# Altium schematic sheet SwitchDecoder.SchDoc
size A3
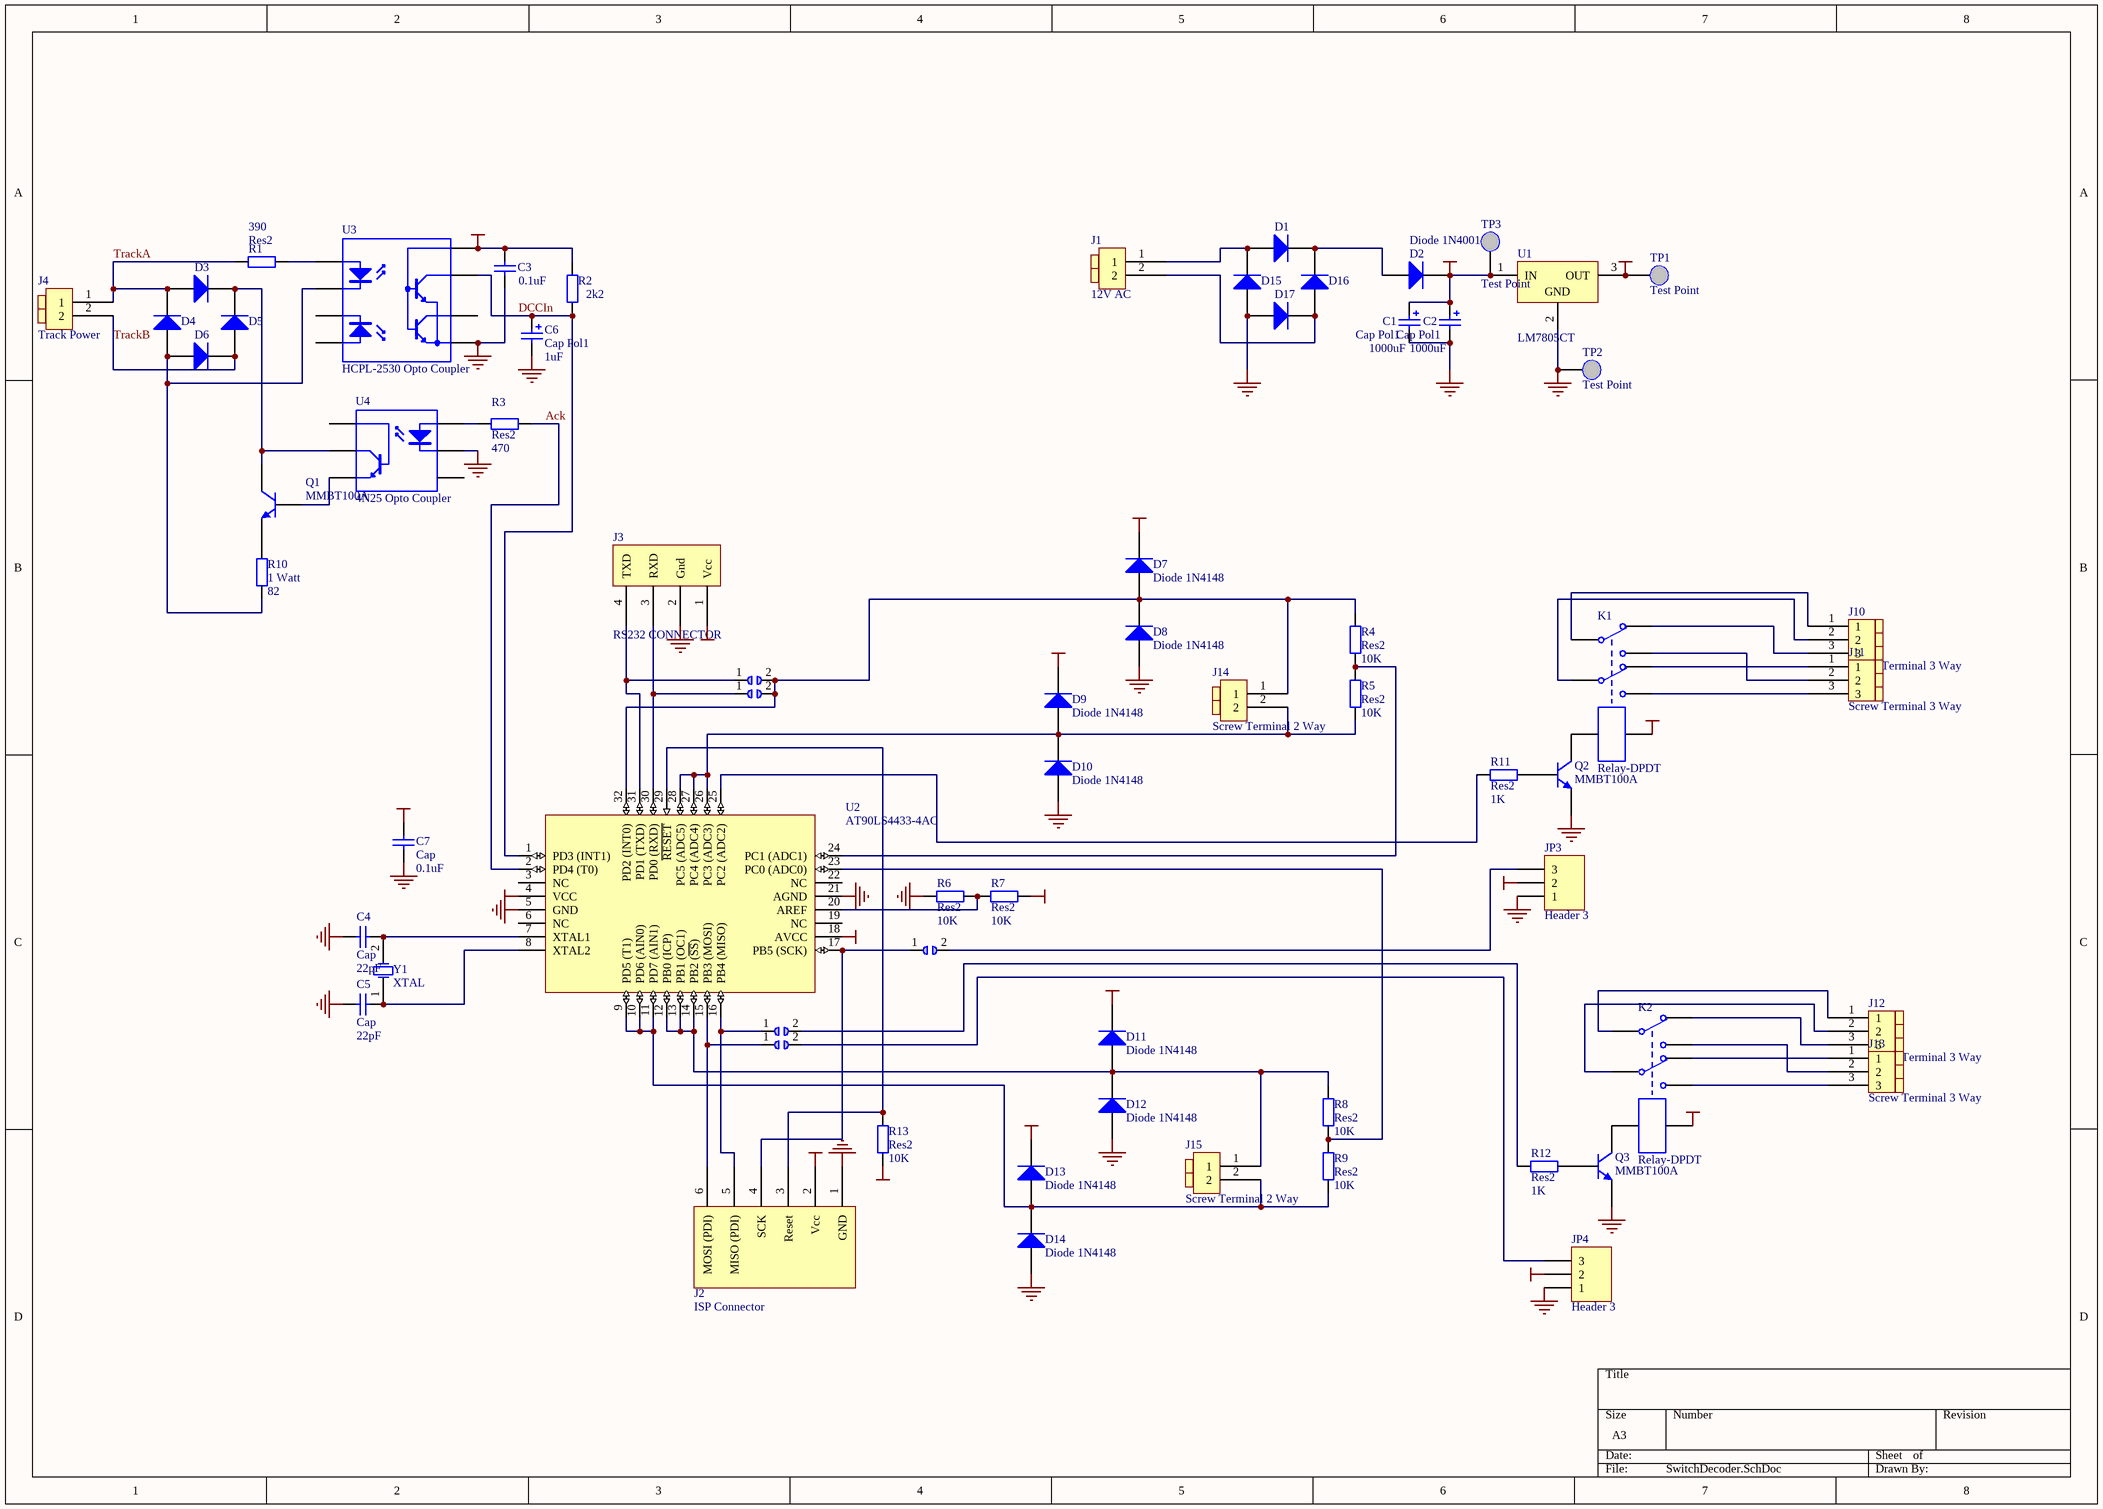
[diagram p0: SwitchDecoder.SchDoc]

## Parts
C1  Cap Pol1  value 1000uF  [CAPPR5-10X10.5]
C2  Cap Pol1  value 1000uF  [CAPPR5-10X10.5]
C3  value 0.1uF  [CC2012-0805]  (hidden comment: Cap)
C4  Cap  value 22pF  [CC2012-0805]
C5  Cap  value 22pF  [CC2012-0805]
C6  Cap Pol1  value 1uF  [CC3216-1206]
C7  Cap  value 0.1uF  [CC2012-0805]
D1  Diode 1N4004  [DIO10.46-5.3x2.8]  (value not drawn)
D2  Diode 1N4001  [DIO10.46-5.3x2.8]
D3  Diode 1N4148  [DIO7.1-3.9x1.9]  (value not drawn)
D4  Diode 1N4148  [DIO7.1-3.9x1.9]  (value not drawn)
D5  Diode 1N4148  [DIO7.1-3.9x1.9]  (value not drawn)
D6  Diode 1N4148  [DIO7.1-3.9x1.9]  (value not drawn)
D7  Diode 1N4148  [DIO7.1-3.9x1.9]
D8  Diode 1N4148  [DIO7.1-3.9x1.9]
D9  Diode 1N4148  [DIO7.1-3.9x1.9]
D10  Diode 1N4148  [DIO7.1-3.9x1.9]
D11  Diode 1N4148  [DIO7.1-3.9x1.9]
D12  Diode 1N4148  [DIO7.1-3.9x1.9]
D13  Diode 1N4148  [DIO7.1-3.9x1.9]
D14  Diode 1N4148  [DIO7.1-3.9x1.9]
D15  Diode 1N4004  [DIO10.46-5.3x2.8]  (value not drawn)
D16  Diode 1N4004  [DIO10.46-5.3x2.8]  (value not drawn)
D17  Diode 1N4004  [DIO10.46-5.3x2.8]  (value not drawn)
J1  12V AC  [Screw Terminal 2 way 0.2]
J2  ISP Connector  [0.1 SIP 6 PIN]
J3  RS232 CONNECTOR  [0.1 SIP 4 PIN]
J4  Track Power  [Screw Terminal 2 way 0.2]
J5  Jumper  [Jumper]  (value not drawn)
J6  Jumper  [Jumper]  (value not drawn)
J7  Jumper  [Jumper]  (value not drawn)
J8  Jumper  [Jumper]  (value not drawn)
J9  Jumper  [Jumper]  (value not drawn)
J10  Screw Terminal 3 Way  [Screw Terminal 3 way 0.2]
J11  Screw Terminal 3 Way  [Screw Terminal 3 way 0.2]
J12  Screw Terminal 3 Way  [Screw Terminal 3 way 0.2]
J13  Screw Terminal 3 Way  [Screw Terminal 3 way 0.2]
J14  Screw Terminal 2 Way  [Screw Terminal 2 way 0.2]
J15  Screw Terminal 2 Way  [Screw Terminal 2 way 0.2]
JP3  Header 3  [HDR1X3]
JP4  Header 3  [HDR1X3]
K1  Relay-DPDT  [RelayDPDT]
K2  Relay-DPDT  [RelayDPDT]
Q1  MMBT100A  [SO-G3]
Q2  MMBT100A  [SO-G3]
Q3  MMBT100A  [SO-G3]
R1  Res2  value 390  [CR2012-0805]
R2  value 2k2  [CR2012-0805]  (hidden comment: Res2)
R3  Res2  value 470  [CR2012-0805]
R4  Res2  value 10K  [CR2012-0805]
R5  Res2  value 10K  [CR2012-0805]
R6  Res2  value 10K  [CR2012-0805]
R7  Res2  value 10K  [CR2012-0805]
R8  Res2  value 10K  [CR2012-0805]
R9  Res2  value 10K  [CR2012-0805]
R10  1 Watt  value 82  [AXIAL-0.6]
R11  Res2  value 1K  [CR2012-0805]
R12  Res2  value 1K  [CR2012-0805]
R13  Res2  value 10K  [CR2012-0805]
TP1  Test Point  [TestPoint]
TP2  Test Point  [TestPoint]
TP3  Test Point  [TestPoint]
U1  LM7805CT  [TO-3 with HS Clip]
U2  AT90LS4433-4AC  [32A]
U3  HCPL-2530 Opto Coupler  [8P3]
U4  4N25 Opto Coupler  [DIP6]
Y1  XTAL  [RAD-0.2]

## Nets
GND: C1.2 C2.2 C3.1 C4.1 C5.1 C6.2 C7.1 D8.1(A) D10.1(A) D12.1(A) D14.1(A) D15.1(A) D17.1(A) J2.1(GND) J3.2(Gnd) JP3.1 JP4.1 Q2.2(E) Q3.2(E) R6.1 TP2.1 U1.2(GND) U2.5(GND) U2.21(AGND) U3.5(E) U4.2(K)
VCC: C3.2 C7.2 D7.2(K) D9.2(K) D11.2(K) D13.2(K) J2.2(Vcc) J3.1(Vcc) JP3.2 JP4.2 R2.2 R7.2 R13.1 TP1.1 U1.3(OUT) U2.4(VCC) U2.18(AVCC) U3.8(E)
Vdd: C1.1 C2.1 D2.2(K) K1.8 K2.8 TP3.1 U1.1(IN)
Ack: R3.2 U2.2(PD4_(T0))
DCCIn: C6.1 R2.1 U2.1(PD3_(INT1)) U3.7(C)
TrackA: D3.1(A) D4.2(K) J4.1 R1.2
TrackB: D5.1(A) D6.2(K) J4.2
NetC4_2: C4.2 U2.7(XTAL1) Y1.2(OSC2)
NetC5_2: C5.2 U2.8(XTAL2) Y1.1(OSC1)
NetD1_1: D1.1(A) D15.2(K) J1.1
NetD1_2: D1.2(K) D2.1(A) D16.2(K)
NetD3_2: D3.2(K) D5.2(K) Q1.3(C) U4.5(C)
NetD4_1: D4.1(A) D6.1(A) R10.2 U3.2(K)
NetD7_1: D7.1(A) D8.2(K) J5.2 J6.2 J14.1 R4.2 U2.32(PD2_(INT0))
NetD9_1: D9.1(A) D10.2(K) J14.2 R5.1 U2.26(PC3_(ADC3)) U2.27(PC4_(ADC4)) U2.28(PC5_(ADC5))
NetD11_1: D11.1(A) D12.2(K) J15.1 R8.2 U2.12(PB0_(ICP)) U2.13(PB1_(OC1)) U2.14(PB2_(~{SS}))
NetD13_1: D13.1(A) D14.2(K) J15.2 R9.1 U2.9(PD5_(T1)) U2.10(PD6_(AIN0)) U2.11(PD7_(AIN1))
NetD16_1: D16.1(A) D17.2(K) J1.2
NetJ2_3: J2.3(Reset) R13.2 U2.29(~{RESET})
NetJ2_4: J2.4(SCK) J7.1 U2.17(PB5_(SCK))
NetJ2_5: J2.5(MISO_(PDI)) J8.1 U2.16(PB4_(MISO))
NetJ2_6: J2.6(MOSI_(PDI)) J9.1 U2.15(PB3_(MOSI))
NetJ3_3: J3.3(RXD) J6.1 U2.30(PD0_(RXD))
NetJ3_4: J3.4(TXD) J5.1 U2.31(PD1_(TXD))
NetJ7_2: J7.2 JP3.3
NetJ8_2: J8.2 R12.1
NetJ9_2: J9.2 JP4.3
NetJ10_1: J10.1 K1.1
NetJ10_2: J10.2 K1.4
NetJ10_3: J10.3 K1.2
NetJ11_1: J11.1 K1.5
NetJ11_2: J11.2 K1.3
NetJ11_3: J11.3 K1.6
NetJ12_1: J12.1 K2.1
NetJ12_2: J12.2 K2.4
NetJ12_3: J12.3 K2.2
NetJ13_1: J13.1 K2.5
NetJ13_2: J13.2 K2.3
NetJ13_3: J13.3 K2.6
NetK1_7: K1.7 Q2.3(C)
NetK2_7: K2.7 Q3.3(C)
NetQ1_1: Q1.1(B) U4.4(E)
NetQ1_2: Q1.2(E) R10.1
NetQ2_1: Q2.1(B) R11.2
NetQ3_1: Q3.1(B) R12.2
NetR1_1: R1.1 U3.1(A)
NetR3_1: R3.1 U4.1(K)
NetR4_1: R4.1 R5.2 U2.24(PC1_(ADC1))
NetR6_2: R6.2 R7.1 U2.20(AREF)
NetR8_1: R8.1 R9.2 U2.23(PC0_(ADC0))
NetR11_1: R11.1 U2.25(PC2_(ADC2))

Not connected (* = marked no-connect by the designer): U2 3(NC) 6(NC) 19(NC) 22(NC); U3 3(K) 4(A) 6(C); U4 3(N/C) 6(B)

## Library data of the parts
C1 C2 C6 = Cap Pol1: Polarized Capacitor (Radial); Published: 8-Jun-2000; Revision: July-2002: Re-released for DXP Platform.; Publisher: Altium Limited
C3-C5 C7 = Cap: Capacitor; Published: 8-Jun-2000; Revision: July-2002: Re-released for DXP Platform.; Publisher: Altium Limited
D1 D15-D17 = Diode 1N4004: 1 Amp General Purpose Rectifier; Revision 1: 11-Jul-2000: SIM Model Added.; Revision 2: 17-Jul-2002: Re-released for DXP Platform.; Package Information: Latest Revision: Aug-1999; Code - JEDEC: DO-204-AL; Published: 8-Jun-2000; Datasheet: Latest Revision: 1998; Package Reference: DO-41; Publisher: Altium Limited
D2 = Diode 1N4001: 1 Amp General Purpose Rectifier; Revision 1: 11-Jul-2000: SIM Model Added.; Revision 2: 17-Jul-2002: Re-released for DXP Platform.; Package Information: Latest Revision: Aug-1999; Code - JEDEC: DO-204-AL; Published: 8-Jun-2000; Datasheet: Latest Revision: 1998; Package Reference: DO-41; Publisher: Altium Limited
D3-D6 = Diode 1N4148: High Conductance Fast Diode; Revision 1: 11-Jul-2000: SIM Model Added.; Revision 2: 17-Jul-2002: Re-released for DXP Platform.; Code - JEDEC: DO-204-AH; Published: 8-Jun-2000; Datasheet: Latest Revision: 1997; Package Reference: DO-35; Publisher: Altium Limited
D7-D14 = Diode 1N4148: High Conductance Fast Diode; Code - JEDEC: DO-204-AH; Revision 1: 11-Jul-2000: SIM Model Added.; Revision 2: 17-Jul-2002: Re-released for DXP Platform.; Published: 8-Jun-2000; Publisher: Altium Limited; Datasheet: Latest Revision: 1997; Package Reference: DO-35
J1 J4 = Screw Terminal 2 Way
JP3 JP4 = Header 3: Header, 3-Pin; Revision: 17-Jul-2002: Re-released for DXP Platform.; Publisher: Altium Limited
K1 K2 = Relay-DPDT: Dual-Pole Dual-Throw Relay; Published: 24-Mar-1999; Revision: July-2002: Re-released for DXP Platform.; Publisher: Altium Limited
Q1-Q3 = MMBT100A: General Purpose Amplifier NPN Silicon; Package Information: Latest Revision: 1997; Published: 29-Sep-2000; Revision: 17-Jul-2002: Re-released for DXP Platform.; Datasheet: Latest Revision: 1996; Package Reference: 318-08; Publisher: Altium Limited
R1-R13 = Res2: Resistor; Published: 8-Jun-2000; Revision: July-2002: Re-released for DXP Platform.; Publisher: Altium Limited
TP1-TP3 = TestPoint
U1 = LM7805CT: Series 3-Terminal Positive Regulator; Package Information: Latest Revision: 1995; Note: Tab is connected to GND; Published: 15-Apr-2002; Datasheet: Latest Revision: May-1999; Package Reference: T03B; Publisher: Altium Limited
U2 = AT90LS4433-4AC: 8-Bit AVR Microcontroller with 4K Bytes of In-System Programmable Flash Memory; Package Information: Latest Revision: revB, Oct-2001; Code - JEDEC: MS-026-ABA; Published: 17-Sep-2003; Datasheet: Latest Revision: 1042G-AVR-09/02; Package Reference: 32A; Publisher: Altium Limited
U3 = HCPL-2530
U4 = 4N25
Y1 = XTAL: Crystal Oscillator; Published: 8-Jun-2000; Revision: July-2002: Re-released for DXP Platform.; Publisher: Altium Limited